# Altium schematic sheet SX1257.SchDoc: SX1257
size A4; CompanyName: WiSE Lab; Engineer: Anh Luong; Organization: Carnegie Mellon University; Address1: 4720 Forbes Ave; Address2: CIC 2219F; Address3: Pittsburgh, PA 15213; Address4: USA; Revision: 1; SheetNumber: 4; SheetTotal: 4
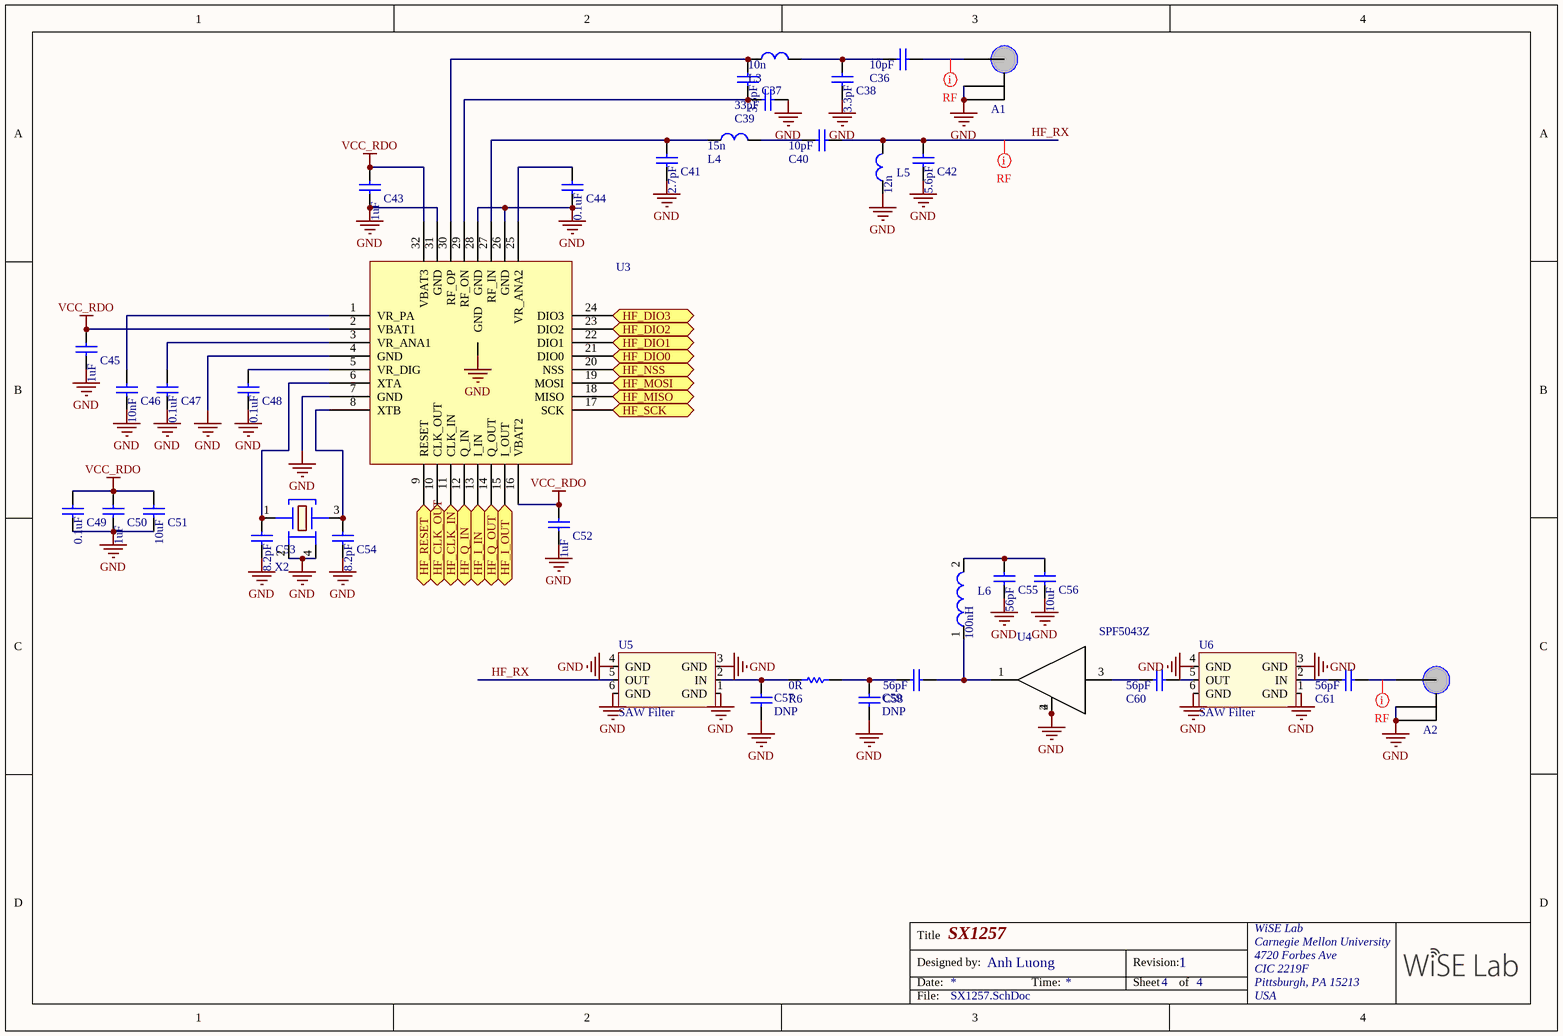
[diagram p0: SX1257.SchDoc]

## Parts
A1  U.FL-R-SMT(01)  [U.FL-R-SMT-1]  (value not drawn)
A2  U.FL-R-SMT(01)  [U.FL-R-SMT-1]  (value not drawn)
C36  GRM1555C1H100FA01D  [CAPC1005X04L]  (value not drawn)
C37  GRM1555C1H3R3CA01D  [CAPC1005X04L]  (value not drawn)
C38  GRM1555C1H3R3CA01D  [CAPC1005X04L]  (value not drawn)
C39  GRM1555C1H330JA01D  [CAPC1005X04L]  (value not drawn)
C40  GRM1555C1H100FA01D  [CAPC1005X04L]  (value not drawn)
C41  GRM1555C1H2R7BA01D  [CAPC1005X04L]  (value not drawn)
C42  GRM1555C1H5R6CA01D  [CAPC1005X04L]  (value not drawn)
C43  GRM155R60J105KE19D  [CAPC1005X04L]  (value not drawn)
C44  GRM155R71C104KA88D  [CAPC1005X04L]  (value not drawn)
C45  GRM155R60J105KE19D  [CAPC1005X04L]  (value not drawn)
C46  GRM155R71E103KA01D  [CAPC1005X04L]  (value not drawn)
C47  GRM155R71C104KA88D  [CAPC1005X04L]  (value not drawn)
C48  GRM155R71C104KA88D  [CAPC1005X04L]  (value not drawn)
C49  GRM155R71C104KA88D  [CAPC1005X04L]  (value not drawn)
C50  GRM155R60J105KE19D  [CAPC1005X04L]  (value not drawn)
C51  GRM155R60J106ME15D  [INDC1005X04L]  (value not drawn)
C52  GRM155R60J105KE19D  [CAPC1005X04L]  (value not drawn)
C53  GRM1555C1H8R2CA01D  [CAPC1005X04L]  (value not drawn)
C54  GRM1555C1H8R2CA01D  [CAPC1005X04L]  (value not drawn)
C55  GRM1555C1H560JA01D  [CAPC1005X04L]  (value not drawn)
C56  GRM155R60J106ME15D  [INDC1005X04L]  (value not drawn)
C57  value DNP  [CAPC1005X04L]  (hidden comment: C_DNP)
C58  GRM1555C1H560JA01D  [CAPC1005X04L]  (value not drawn)
C59  value DNP  [CAPC1005X04L]  (hidden comment: C_DNP)
C60  GRM1555C1H560JA01D  [CAPC1005X04L]  (value not drawn)
C61  GRM1555C1H560JA01D  [CAPC1005X04L]  (value not drawn)
L3  LQG15HS10NJ02D  [INDC1005X04L]  (value not drawn)
L4  LQG15HS15NJ02D  [INDC1005X04L]  (value not drawn)
L5  LQG15HN12NJ02D  [INDC1005X04L]  (value not drawn)
L6  LQG15HSR10J02D  [INDC1005X04L]  (value not drawn)
R6  PMR01ZZPJ000  [RESC1005X04N]  (value not drawn)
U3  SX1257IWLTRT  [QFN50P500X500X80_HS-33N]  (value not drawn)
U4  SPF5043Z  [SOT-343]
U5  SAW Filter  [DCC6C_3.0x3.0mm]
U6  SAW Filter  [DCC6C_3.0x3.0mm]
X2  ABM11-36.000MHZ-D2X-T3  [2.0x1.6x0.59mmXTAL]  (value not drawn)

## Ports
HF_CLK_IN, HF_CLK_OUT, HF_DIO0, HF_DIO1, HF_DIO2, HF_DIO3, HF_I_IN, HF_I_OUT, HF_MISO, HF_MOSI, HF_NSS, HF_Q_IN, HF_Q_OUT, HF_RESET, HF_SCK

## Nets
GND: A1.2 A1.3 A2.2 A2.3 C38.1 C39.2 C41.1 C42.1 C43.1 C44.1 C45.1 C46.1 C47.1 C48.1 C49.1 C50.1 C51.1 C52.1 C53.1 C54.1 C55.1 C56.1 C57.1 C59.1 L5.1 U3.4(GND) U3.7(GND) U3.26(GND) U3.28(GND) U3.31(GND) U3.33(GND) U4.2(GND1) U4.4(GND2) U5.1(GND) U5.3(GND) U5.4(GND) U5.6(GND) U6.1(GND) U6.3(GND) U6.4(GND) U6.6(GND) X2.2 X2.4
VCC_RDO: C43.2 C45.2 C49.2 C50.2 C51.2 C52.2 U3.2(VBAT1) U3.16(VBAT2) U3.32(VBAT3)
HF_CLK_IN: U3.11(CLK_IN) ; port HF_CLK_IN
HF_CLK_OUT: U3.10(CLK_OUT) ; port HF_CLK_OUT
HF_DIO0: U3.21(DIO0) ; port HF_DIO0
HF_DIO1: U3.22(DIO1) ; port HF_DIO1
HF_DIO2: U3.23(DIO2) ; port HF_DIO2
HF_DIO3: U3.24(DIO3) ; port HF_DIO3
HF_I_IN: U3.13(I_IN) ; port HF_I_IN
HF_I_OUT: U3.15(I_OUT) ; port HF_I_OUT
HF_MISO: U3.18(MISO) ; port HF_MISO
HF_MOSI: U3.19(MOSI) ; port HF_MOSI
HF_NSS: U3.20(NSS) ; port HF_NSS
HF_Q_IN: U3.12(Q_IN) ; port HF_Q_IN
HF_Q_OUT: U3.14(Q_OUT) ; port HF_Q_OUT
HF_RESET: U3.9(RESET) ; port HF_RESET
HF_RX: C40.2 C42.2 L5.2 U5.5(OUT)
HF_SCK: U3.17(SCK) ; port HF_SCK
NetA1_1: A1.1 C36.2
NetA2_1: A2.1 C61.2
NetC36_1: C36.1 C38.2 L3.2
NetC37_1: C37.1 C39.1 U3.29(RF_ON)
NetC37_2: C37.2 L3.1 U3.30(RF_OP)
NetC40_1: C40.1 L4.2
NetC41_2: C41.2 L4.1 U3.27(RF_IN)
NetC44_2: C44.2 U3.25(VR_ANA2)
NetC46_2: C46.2 U3.1(VR_PA)
NetC47_2: C47.2 U3.3(VR_ANA1)
NetC48_2: C48.2 U3.5(VR_DIG)
NetC53_2: C53.2 U3.6(XTA) X2.1
NetC54_2: C54.2 U3.8(XTB) X2.3
NetC55_2: C55.2 C56.2 L6.2
NetC57_2: C57.2 R6.1 U5.2(IN)
NetC58_1: C58.1 C59.2 R6.2
NetC58_2: C58.2 L6.1 U4.1(OUT)
NetC60_1: C60.1 U4.3(IN)
NetC60_2: C60.2 U6.5(OUT)
NetC61_1: C61.1 U6.2(IN)

## Layout directives
net class RF: HF_RX, NetA1_1, NetA2_1

## Notes on the sheet
- Title
- Designed by:
- Date:
- Time:
- Revision:
- Sheet
- of
- File:
- (in symbol GRM155R60J105KE19D) 1uF
- (in symbol GRM155R60J106ME15D) 10uF
- (in symbol GRM155R71C104KA88D) 0.1uF
- (in symbol GRM155R71E103KA01D) 10nF
- (in symbol GRM1555C1H2R7BA01D) 2.7pF
- (in symbol GRM1555C1H3R3CA01D) 3.3pF
- (in symbol GRM1555C1H5R6CA01D) 5.6pF
- (in symbol GRM1555C1H8R2CA01D) 8.2pF
- (in symbol GRM1555C1H100FA01D) 10pF
- (in symbol GRM1555C1H330JA01D) 33pF
- (in symbol GRM1555C1H560JA01D) 56pF
- (in symbol LQG15HN12NJ02D) 12n
- (in symbol LQG15HS10NJ02D) 10n
- (in symbol LQG15HS15NJ02D) 15n
- (in symbol LQG15HSR10J02D) 100nH
- (in symbol PMR01ZZPJ000) 0R

## Library data of the parts
A1 A2 = U.FL-R-SMT(01): CONN UMC JACK STR 50 OHM SMD; Manufacturer: Hirose Electric Co Ltd; Connector Style: Ultra Miniature Coaxial; Connector Type: Jack, Male Pin; Contact Termination: Solder; Impedance: 50 Ohm; Frequency - Max: 6GHz; Body Material: Phosphor Bronze; Body Finish: Silver; Center Contact Plating: Gold; Dielectric Material: Liquid Crystal Polymer (LCP); Supplier 1: Digi-Key; Manufacturer Part Number: U.FL-R-SMT(01); RoHS: RoHS Compliant; Category: Connectors, Interconnects; Stock 1: 22286; Pricing 1: 1=1.28, 10=1.122, 25=1.056, 50=1.012, 100=0.968, 250=0.88, 500=0.792, 1000=0.704, 2500=0.638 (USD); Packaging: Bulk; Shield Termination: Solder; Mounting Type: Surface Mount; Cable Group: -; Fastening Type: Snap-On; Features: -; Housing Color: Silver; Ingress Protection: -; Center Contact Material: Phosphor Bronze; Voltage Rating: -; Operating Temperature: -40°C ~ 90°C; ComponentLink1URL: http://www.hirose.co.jp/cataloge_hp/e32119372.pdf; ComponentLink1Description: http://www.hirose.co.jp/cataloge_hp/e32119372.pdf
C36 C40 = GRM1555C1H100FA01D: CAP CER 10PF 50V C0G/NP0 0402; Manufacturer: Murata Electronics North America; Tolerance: ±1%; Temperature Coefficient: C0G, NP0; Supplier 1: Digi-Key; Manufacturer Part Number: GRM1555C1H100FA01D; RoHS: RoHS Compliant; Category: Capacitors; Stock 1: 305587; Pricing 1: 1=0.1, 10=0.05, 100=0.0223, 500=0.01594, 1000=0.01252, 2500=0.01138, 5000=0.01047 (USD); Packaging: Cut Tape (CT); Part Status: Active; Voltage - Rated: 50V; Operating Temperature: -55°C ~ 125°C; Features: -; Ratings: -; Applications: General Purpose; Mounting Type: Surface Mount, MLCC; Package / Case: 0402 (1005 Metric); Size / Dimension: 0.039" L x 0.020" W (1.00mm x 0.50mm); Height - Seated (Max): -; Thickness (Max): 0.022" (0.55mm); Lead Spacing: -; Lead Style: -; ComponentLink1URL: http://www.murata.com/~/media/webrenewal/support/library/catalog/products/capacitor/mlcc/c02e.pdf; ComponentLink1Description: http://www.murata.com/~/media/webrenewal/support/library/catalog/products/capacitor/mlcc/c02e.pdf; Supplier Part Number 1: 490-6186-1-ND
C37 C38 = GRM1555C1H3R3CA01D: CAP CER 3.3PF 50V C0G/NP0 0402; Manufacturer: Murata Electronics North America; Tolerance: ±0.25pF; Temperature Coefficient: C0G, NP0; Supplier 1: Digi-Key; Manufacturer Part Number: GRM1555C1H3R3CA01D; RoHS: RoHS Compliant; Category: Capacitors; Stock 1: 124068; Pricing 1: 1=0.1, 10=0.014, 100=0.0062, 500=0.00442, 1000=0.00348, 2500=0.00316, 5000=0.00291 (USD); Packaging: Cut Tape (CT); Part Status: Active; Voltage - Rated: 50V; Operating Temperature: -55°C ~ 125°C; Features: -; Ratings: -; Applications: General Purpose; Mounting Type: Surface Mount, MLCC; Package / Case: 0402 (1005 Metric); Size / Dimension: 0.039" L x 0.020" W (1.00mm x 0.50mm); Height - Seated (Max): -; Thickness (Max): 0.022" (0.55mm); Lead Spacing: -; Lead Style: -; ComponentLink1URL: http://www.murata.com/~/media/webrenewal/support/library/catalog/products/capacitor/mlcc/c02e.pdf; ComponentLink1Description: http://www.murata.com/~/media/webrenewal/support/library/catalog/products/capacitor/mlcc/c02e.pdf; Supplier Part Number 1: 490-5938-1-ND
C39 = GRM1555C1H330JA01D: CAP CER 33PF 50V C0G/NP0 0402; Manufacturer: Murata Electronics North America; Tolerance: ±5%; Temperature Coefficient: C0G, NP0; Supplier 1: Digi-Key; Manufacturer Part Number: GRM1555C1H330JA01D; RoHS: RoHS Compliant; Category: Capacitors; Stock 1: 295196; Pricing 1: 1=0.1, 10=0.015, 100=0.0067, 500=0.00478, 1000=0.00375, 2500=0.00341, 5000=0.00314 (USD); Packaging: Cut Tape (CT); Part Status: Active; Voltage - Rated: 50V; Operating Temperature: -55°C ~ 125°C; Features: -; Ratings: -; Applications: General Purpose; Mounting Type: Surface Mount, MLCC; Package / Case: 0402 (1005 Metric); Size / Dimension: 0.039" L x 0.020" W (1.00mm x 0.50mm); Height - Seated (Max): -; Thickness (Max): 0.022" (0.55mm); Lead Spacing: -; Lead Style: -; ComponentLink1URL: http://www.murata.com/~/media/webrenewal/support/library/catalog/products/capacitor/mlcc/c02e.pdf; ComponentLink1Description: http://www.murata.com/~/media/webrenewal/support/library/catalog/products/capacitor/mlcc/c02e.pdf; Supplier Part Number 1: 490-5936-1-ND
C41 = GRM1555C1H2R7BA01D: CAP CER 2.7PF 50V C0G/NP0 0402; Manufacturer: Murata Electronics North America; Tolerance: ±0.1pF; Temperature Coefficient: C0G, NP0; Supplier 1: Digi-Key; Manufacturer Part Number: GRM1555C1H2R7BA01D; RoHS: RoHS Compliant; Category: Capacitors; Stock 1: 605754; Pricing 1: 1=0.1, 10=0.031, 100=0.0136, 500=0.00974, 1000=0.00765, 2500=0.00696, 5000=0.0064 (USD); Packaging: Cut Tape (CT); Part Status: Active; Voltage - Rated: 50V; Operating Temperature: -55°C ~ 125°C; Features: -; Ratings: -; Applications: General Purpose; Mounting Type: Surface Mount, MLCC; Package / Case: 0402 (1005 Metric); Size / Dimension: 0.039" L x 0.020" W (1.00mm x 0.50mm); Height - Seated (Max): -; Thickness (Max): 0.022" (0.55mm); Lead Spacing: -; Lead Style: -; ComponentLink1URL: http://www.murata.com/~/media/webrenewal/support/library/catalog/products/capacitor/mlcc/c02e.pdf; ComponentLink1Description: http://www.murata.com/~/media/webrenewal/support/library/catalog/products/capacitor/mlcc/c02e.pdf; Supplier Part Number 1: 490-6229-1-ND
C42 = GRM1555C1H5R6CA01D: CAP CER 5.6PF 50V C0G/NP0 0402; Manufacturer: Murata Electronics North America; Tolerance: ±0.25pF; Temperature Coefficient: C0G, NP0; Supplier 1: Digi-Key; Manufacturer Part Number: GRM1555C1H5R6CA01D; RoHS: RoHS Compliant; Category: Capacitors; Stock 1: 592221; Pricing 1: 1=0.1, 10=0.032, 100=0.0143, 500=0.0102, 1000=0.00802, 2500=0.00729, 5000=0.0067 (USD); Packaging: Cut Tape (CT); Part Status: Active; Voltage - Rated: 50V; Operating Temperature: -55°C ~ 125°C; Features: -; Ratings: -; Applications: General Purpose; Mounting Type: Surface Mount, MLCC; Package / Case: 0402 (1005 Metric); Size / Dimension: 0.039" L x 0.020" W (1.00mm x 0.50mm); Height - Seated (Max): -; Thickness (Max): 0.022" (0.55mm); Lead Spacing: -; Lead Style: -; ComponentLink1URL: http://www.murata.com/~/media/webrenewal/support/library/catalog/products/capacitor/mlcc/c02e.pdf; ComponentLink1Description: http://www.murata.com/~/media/webrenewal/support/library/catalog/products/capacitor/mlcc/c02e.pdf; Supplier Part Number 1: 490-6250-1-ND
C43 C45 C50 C52 = GRM155R60J105KE19D: CAP CER 1UF 6.3V X5R 0402; Manufacturer: Murata Electronics North America; Tolerance: ±10%; Supplier 1: Digi-Key; Manufacturer Part Number: GRM155R60J105KE19D; RoHS: RoHS Compliant; Category: Capacitors; Stock 1: 2790642; Pricing 1: 1=0.1, 10=0.024, 100=0.0108, 500=0.0077, 1000=0.00605, 2500=0.0055, 5000=0.00506 (USD); Packaging: Cut Tape (CT); Part Status: Active; Voltage - Rated: 6.3V; Temperature Coefficient: X5R; Operating Temperature: -55°C ~ 85°C; Features: -; Ratings: -; Applications: General Purpose; Mounting Type: Surface Mount, MLCC; Package / Case: 0402 (1005 Metric); Size / Dimension: 0.039" L x 0.020" W (1.00mm x 0.50mm); Height - Seated (Max): -; Thickness (Max): 0.022" (0.55mm); Lead Spacing: -; Lead Style: -; ComponentLink1URL: http://www.murata.com/~/media/webrenewal/support/library/catalog/products/capacitor/mlcc/c02e.pdf; ComponentLink1Description: http://www.murata.com/~/media/webrenewal/support/library/catalog/products/capacitor/mlcc/c02e.pdf; Supplier Part Number 1: 490-1320-1-ND
C44 C47-C49 = GRM155R71C104KA88D: CAP CER 0.1UF 16V X7R 0402; Manufacturer: Murata Electronics North America; Tolerance: ±10%; Supplier 1: Digi-Key; Manufacturer Part Number: GRM155R71C104KA88D; RoHS: RoHS Compliant; Category: Capacitors; Stock 1: 38255872; Pricing 1: 1=0.1, 10=0.014, 100=0.0062, 500=0.00442, 1000=0.00348, 2500=0.00316, 5000=0.00291 (USD); Packaging: Cut Tape (CT); Part Status: Active; Voltage - Rated: 16V; Temperature Coefficient: X7R; Operating Temperature: -55°C ~ 125°C; Features: -; Ratings: -; Applications: General Purpose; Mounting Type: Surface Mount, MLCC; Package / Case: 0402 (1005 Metric); Size / Dimension: 0.039" L x 0.020" W (1.00mm x 0.50mm); Height - Seated (Max): -; Thickness (Max): 0.022" (0.55mm); Lead Spacing: -; Lead Style: -; ComponentLink1URL: http://www.murata.com/~/media/webrenewal/support/library/catalog/products/capacitor/mlcc/c02e.pdf; ComponentLink1Description: http://www.murata.com/~/media/webrenewal/support/library/catalog/products/capacitor/mlcc/c02e.pdf; Supplier Part Number 1: 490-3261-1-ND
C46 = GRM155R71E103KA01D: CAP CER 10000PF 25V X7R 0402; Manufacturer: Murata Electronics North America; Tolerance: ±10%; Supplier 1: Digi-Key; Manufacturer Part Number: GRM155R71E103KA01D; RoHS: RoHS Compliant; Category: Capacitors; Stock 1: 8083248; Pricing 1: 1=0.1, 10=0.013, 100=0.0056, 500=0.004, 1000=0.00315, 2500=0.00286, 5000=0.00263 (USD); Packaging: Cut Tape (CT); Part Status: Active; Voltage - Rated: 25V; Temperature Coefficient: X7R; Operating Temperature: -55°C ~ 125°C; Features: -; Ratings: -; Applications: General Purpose; Mounting Type: Surface Mount, MLCC; Package / Case: 0402 (1005 Metric); Size / Dimension: 0.039" L x 0.020" W (1.00mm x 0.50mm); Height - Seated (Max): -; Thickness (Max): 0.022" (0.55mm); Lead Spacing: -; Lead Style: -; ComponentLink1URL: http://www.murata.com/~/media/webrenewal/support/library/catalog/products/capacitor/mlcc/c02e.pdf; ComponentLink1Description: http://www.murata.com/~/media/webrenewal/support/library/catalog/products/capacitor/mlcc/c02e.pdf; Supplier Part Number 1: 490-1312-1-ND
C51 C56 = GRM155R60J106ME15D: CAP CER 10UF 6.3V X5R 0402; Manufacturer: Murata Electronics North America; Tolerance: ±20%; Supplier 1: Digi-Key; Manufacturer Part Number: GRM155R60J106ME15D; RoHS: RoHS Compliant; Category: Capacitors; Stock 1: 183912; Pricing 1: 1=0.24, 10=0.16, 100=0.0813, 500=0.0556, 1000=0.04918, 2500=0.04704, 5000=0.04277 (USD); Packaging: Cut Tape (CT); Part Status: Active; Voltage - Rated: 6.3V; Temperature Coefficient: X5R; Operating Temperature: -55°C ~ 85°C; Features: Derating Recommended; Ratings: -; Applications: General Purpose; Mounting Type: Surface Mount, MLCC; Package / Case: 0402 (1005 Metric); Size / Dimension: 0.039" L x 0.020" W (1.00mm x 0.50mm); Height - Seated (Max): -; Thickness (Max): 0.026" (0.65mm); Lead Spacing: -; Lead Style: -; ComponentLink1URL: http://www.murata.com/~/media/webrenewal/support/library/catalog/products/capacitor/mlcc/c02e.pdf; ComponentLink1Description: http://www.murata.com/~/media/webrenewal/support/library/catalog/products/capacitor/mlcc/c02e.pdf; Supplier Part Number 1: 490-13238-1-ND
C53 C54 = GRM1555C1H8R2CA01D: CAP CER 8.2PF 50V C0G/NP0 0402; Manufacturer: Murata Electronics North America; Tolerance: ±0.25pF; Temperature Coefficient: C0G, NP0; Supplier 1: Digi-Key; Manufacturer Part Number: GRM1555C1H8R2CA01D; RoHS: RoHS Compliant; Category: Capacitors; Stock 1: 757168; Pricing 1: 1=0.1, 10=0.032, 100=0.0143, 500=0.0102, 1000=0.00802, 2500=0.00729, 5000=0.0067 (USD); Packaging: Cut Tape (CT); Part Status: Active; Voltage - Rated: 50V; Operating Temperature: -55°C ~ 125°C; Features: -; Ratings: -; Applications: General Purpose; Mounting Type: Surface Mount, MLCC; Package / Case: 0402 (1005 Metric); Size / Dimension: 0.039" L x 0.020" W (1.00mm x 0.50mm); Height - Seated (Max): -; Thickness (Max): 0.022" (0.55mm); Lead Spacing: -; Lead Style: -; ComponentLink1URL: http://www.murata.com/~/media/webrenewal/support/library/catalog/products/capacitor/mlcc/c02e.pdf; ComponentLink1Description: http://www.murata.com/~/media/webrenewal/support/library/catalog/products/capacitor/mlcc/c02e.pdf; Supplier Part Number 1: 490-6256-1-ND
C55 C58 C60 C61 = GRM1555C1H560JA01D: CAP CER 56PF 50V C0G/NP0 0402; Manufacturer: Murata Electronics North America; Tolerance: ±5%; Temperature Coefficient: C0G, NP0; Supplier 1: Digi-Key; Manufacturer Part Number: GRM1555C1H560JA01D; RoHS: RoHS Compliant; Category: Capacitors; Stock 1: 623532; Pricing 1: 1=0.1, 10=0.014, 100=0.0062, 500=0.00442, 1000=0.00348, 2500=0.00316, 5000=0.00291 (USD); Packaging: Cut Tape (CT); Part Status: Active; Voltage - Rated: 50V; Operating Temperature: -55°C ~ 125°C; Features: -; Ratings: -; Applications: General Purpose; Mounting Type: Surface Mount, MLCC; Package / Case: 0402 (1005 Metric); Size / Dimension: 0.039" L x 0.020" W (1.00mm x 0.50mm); Height - Seated (Max): -; Thickness (Max): 0.022" (0.55mm); Lead Spacing: -; Lead Style: -; ComponentLink1URL: http://www.murata.com/~/media/webrenewal/support/library/catalog/products/capacitor/mlcc/c02e.ashx?la=en-us; ComponentLink1Description: http://www.murata.com/~/media/webrenewal/support/library/catalog/products/capacitor/mlcc/c02e.ashx?la=en-us; Supplier Part Number 1: 490-1288-1-ND
L3 = LQG15HS10NJ02D: FIXED IND 10NH 500MA 260 MOHM; Manufacturer: Murata Electronics North America; Type: Multilayer; Tolerance: ±5%; Shielding: Unshielded; DC Resistance (DCR): 260 mOhm Max; Q @ Freq: 8 @ 100MHz; Supplier 1: Digi-Key; Manufacturer Part Number: LQG15HS10NJ02D; RoHS: RoHS Compliant; Category: Inductors, Coils, Chokes; Stock 1: 72900; Pricing 1: 1=0.1, 10=0.061, 100=0.0404, 500=0.03366, 1000=0.02827, 2500=0.02423 (USD); Packaging: Cut Tape (CT); Part Status: Active; Material - Core: -; Ratings: -; Operating Temperature: -55°C ~ 125°C; Mounting Type: Surface Mount; Package / Case: 0402 (1005 Metric); Supplier Device Package: 0402 (1005 Metric); Size / Dimension: 0.039" L x 0.020" W (1.00mm x 0.50mm); Height - Seated (Max): 0.022" (0.55mm); ComponentLink1URL: http://search.murata.co.jp/Ceramy/image/img/P02/JELF243B-0010.pdf; ComponentLink1Description: http://search.murata.co.jp/Ceramy/image/img/P02/JELF243B-0010.pdf; Supplier Part Number 1: 490-2623-1-ND
L4 = LQG15HS15NJ02D: FIXED IND 15NH 450MA 320 MOHM; Manufacturer: Murata Electronics North America; Type: Multilayer; Tolerance: ±5%; Shielding: Unshielded; DC Resistance (DCR): 320 mOhm Max; Q @ Freq: 8 @ 100MHz; Supplier 1: Digi-Key; Manufacturer Part Number: LQG15HS15NJ02D; RoHS: RoHS Compliant; Category: Inductors, Coils, Chokes; Stock 1: 162998; Pricing 1: 1=0.1, 10=0.061, 100=0.0404, 500=0.03366, 1000=0.02827, 2500=0.02423 (USD); Packaging: Cut Tape (CT); Part Status: Active; Material - Core: -; Ratings: -; Operating Temperature: -55°C ~ 125°C; Mounting Type: Surface Mount; Package / Case: 0402 (1005 Metric); Supplier Device Package: 0402 (1005 Metric); Size / Dimension: 0.039" L x 0.020" W (1.00mm x 0.50mm); Height - Seated (Max): 0.022" (0.55mm); ComponentLink1URL: http://search.murata.co.jp/Ceramy/image/img/P02/JELF243B-0010.pdf; ComponentLink1Description: http://search.murata.co.jp/Ceramy/image/img/P02/JELF243B-0010.pdf; Supplier Part Number 1: 490-2625-1-ND
L5 = LQG15HN12NJ02D: FIXED IND 12NH 400MA 410 MOHM; Manufacturer: Murata Electronics North America; Type: Multilayer; Tolerance: ±5%; Shielding: Unshielded; DC Resistance (DCR): 410 mOhm Max; Q @ Freq: 8 @ 100MHz; Supplier 1: Digi-Key; Manufacturer Part Number: LQG15HN12NJ02D; RoHS: RoHS Compliant; Category: Inductors, Coils, Chokes; Stock 1: 35497; Pricing 1: 1=0.1, 10=0.061, 100=0.0404, 500=0.03366, 1000=0.02827, 2500=0.02423 (USD); Packaging: Cut Tape (CT); Part Status: Active; Material - Core: -; Ratings: -; Operating Temperature: -55°C ~ 125°C; Mounting Type: Surface Mount; Package / Case: 0402 (1005 Metric); Supplier Device Package: 0402 (1005 Metric); Size / Dimension: 0.039" L x 0.020" W (1.00mm x 0.50mm); Height - Seated (Max): 0.022" (0.55mm); ComponentLink1URL: http://search.murata.co.jp/Ceramy/image/img/P02/JELF243B-0009.pdf; ComponentLink1Description: http://search.murata.co.jp/Ceramy/image/img/P02/JELF243B-0009.pdf; Supplier Part Number 1: 490-1086-1-ND
L6 = LQG15HSR10J02D: FIXED IND 100NH 200MA 1.25 OHM; Manufacturer: Murata Electronics North America; Type: Multilayer; Tolerance: ±5%; Shielding: Unshielded; DC Resistance (DCR): 1.25 Ohm Max; Q @ Freq: 8 @ 100MHz; Supplier 1: Digi-Key; Manufacturer Part Number: LQG15HSR10J02D; RoHS: RoHS Compliant; Category: Inductors, Coils, Chokes; Stock 1: 86447; Pricing 1: 1=0.1, 10=0.071, 100=0.0476, 500=0.03968, 1000=0.03333, 2500=0.02857 (USD); Packaging: Cut Tape (CT); Part Status: Active; Material - Core: -; Ratings: -; Operating Temperature: -55°C ~ 125°C; Mounting Type: Surface Mount; Package / Case: 0402 (1005 Metric); Supplier Device Package: 0402 (1005 Metric); Size / Dimension: 0.039" L x 0.020" W (1.00mm x 0.50mm); Height - Seated (Max): 0.022" (0.55mm); ComponentLink1URL: http://search.murata.co.jp/Ceramy/image/img/P02/JELF243B-0010.pdf; ComponentLink1Description: http://search.murata.co.jp/Ceramy/image/img/P02/JELF243B-0010.pdf; Supplier Part Number 1: 490-2635-1-ND
R6 = PMR01ZZPJ000: RES SMD 0 OHM JUMPER 1/5W 0402; Manufacturer: Rohm Semiconductor; Power (Watts): 0.2W, 1/5W; Temperature Coefficient: 0/ +200ppm/°C; Supplier 1: Digi-Key; Manufacturer Part Number: PMR01ZZPJ000; RoHS: RoHS Compliant; Category: Resistors; Stock 1: 89225; Pricing 1: 1=1.17, 10=1.016, 25=0.8932, 50=0.8162, 100=0.7084, 250=0.616, 500=0.51128, 1000=0.4158, 5000=0.3967 (USD); Packaging: Cut Tape (CT); Part Status: Active; Tolerance: Jumper; Composition: Thick Film; Features: Automotive AEC-Q200, Current Sense; Operating Temperature: -55°C ~ 155°C; Package / Case: 0402 (1005 Metric); Supplier Device Package: 0402; Size / Dimension: 0.039" L x 0.020" W (1.00mm x 0.50mm); Height - Seated (Max): 0.014" (0.35mm); Failure Rate: -; ComponentLink1URL: http://www.rohm.com/web/global/datasheet/PMR01ZZPJ000/pmr-jpw-e; ComponentLink1Description: http://www.rohm.com/web/global/datasheet/PMR01ZZPJ000/pmr-jpw-e; Supplier Part Number 1: RHM1692-1-ND
U3 = SX1257IWLTRT: IC RF TXRX 802.15.4 32WFQFN; Manufacturer: Semtech Corporation; Modulation: FHSS, FSK, OFDM, O-QPSK; Frequency: 862Mhz ~ 1.02GHz; Power - Output: 8dBm; Serial Interfaces: SPI; Voltage - Supply: 2.7 V ~ 3.6 V; Current - Receiving: 20mA; Current - Transmitting: 58mA; Supplier 1: Digi-Key; Manufacturer Part Number: SX1257IWLTRT; RoHS: RoHS Compliant; Category: RF/IF and RFID; Stock 1: 3538; Pricing 1: 1=7.56, 10=6.93, 25=6.3, 100=5.67, 250=5.19752, 500=4.725, 1000=4.2525 (USD); Packaging: Cut Tape (CT); Part Status: Active; Type: TxRx Only; RF Family/Standard: 802.15.4; Protocol: -; Data Rate (Max): -; Sensitivity: -; Memory Size: -; Operating Temperature: -40°C ~ 85°C; Package / Case: 32-WFQFN Exposed Pad; ComponentLink1URL: http://www.semtech.com/images/datasheet/sx1257.pdf; ComponentLink1Description: http://www.semtech.com/images/datasheet/sx1257.pdf; Supplier Part Number 1: SX1257IWLTRTCT-ND
U4 = SPF5043Z: SPF5043Z; Low Noise Amplifier; RFMD; Frequency: 50MHz ~ 4GHz; P1dB: 22.7dB; Gain: 12.9dB; Noise Figure: 0.8dB; RF Type: Cellular, ISM, PCS; Voltage - Supply: 3 V ~ 5 V; Current - Supply: 46mA; Test Frequency: 1.9GHz; Supplier 1: Digi-Key; Manufacturer: RFMD; Manufacturer Part Number: SPF5043Z; RoHS: RoHS Compliant; Category: RF/IF and RFID; Stock 1: 12; Pricing 1: 1=2.73, 10=2.47, 25=2.2052, 100=1.9845 (USD); Packaging: Cut Tape (CT); Part Status: Discontinued at Digi-Key; Package / Case: SC-82A, SOT-343; Supplier Device Package: SOT-343; ComponentLink1URL: http://www.rfmd.com/store/downloads/dl/file/id/27713/spf5043z_data_sheet.pdf; ComponentLink1Description: http://www.rfmd.com/store/downloads/dl/file/id/27713/spf5043z_data_sheet.pdf; Supplier Part Number 1: 689-1101-1-ND
U5 U6 = SAW Filter: SAW Filter - Bandpass - TEMEX type
X2 = ABM11-36.000MHZ-D2X-T3: CRYSTAL 36.0000MHZ 10PF SMD; Manufacturer: Abracon LLC; Frequency: 36MHz; Frequency Stability: ±20ppm; ESR (Equivalent Series Resistance): 80 Ohm; Operating Mode: Fundamental; Supplier 1: Digi-Key; Manufacturer Part Number: ABM11-36.000MHZ-D2X-T3; RoHS: RoHS Compliant; Category: Crystals, Oscillators, Resonators; Stock 1: 2790; Pricing 1: 1=1.36, 10=1.301, 50=1.2706, 100=1.089, 500=1.05876, 1000=0.89238 (USD); Packaging: Cut Tape (CT); Part Status: Discontinued at Digi-Key; Type: MHz Crystal; Frequency Tolerance: ±20ppm; Load Capacitance: 10pF; Operating Temperature: -40°C ~ 85°C; Ratings: -; Mounting Type: Surface Mount; Package / Case: 4-SMD, No Lead; Size / Dimension: 0.079" L x 0.063" W (2.00mm x 1.60mm); Height - Seated (Max): 0.023" (0.59mm); ComponentLink1URL: http://www.abracon.com/Resonators/ABM11.pdf; ComponentLink1Description: http://www.abracon.com/Resonators/ABM11.pdf; Supplier Part Number 1: 535-10947-1-ND
C57 C59 = C_DNP: Mounting Type: Surface Mount, MLCC; Applications: General Purpose; Package / Case: 0603 (1608 Metric)